# Altium project nixie_clock.PrjPcb
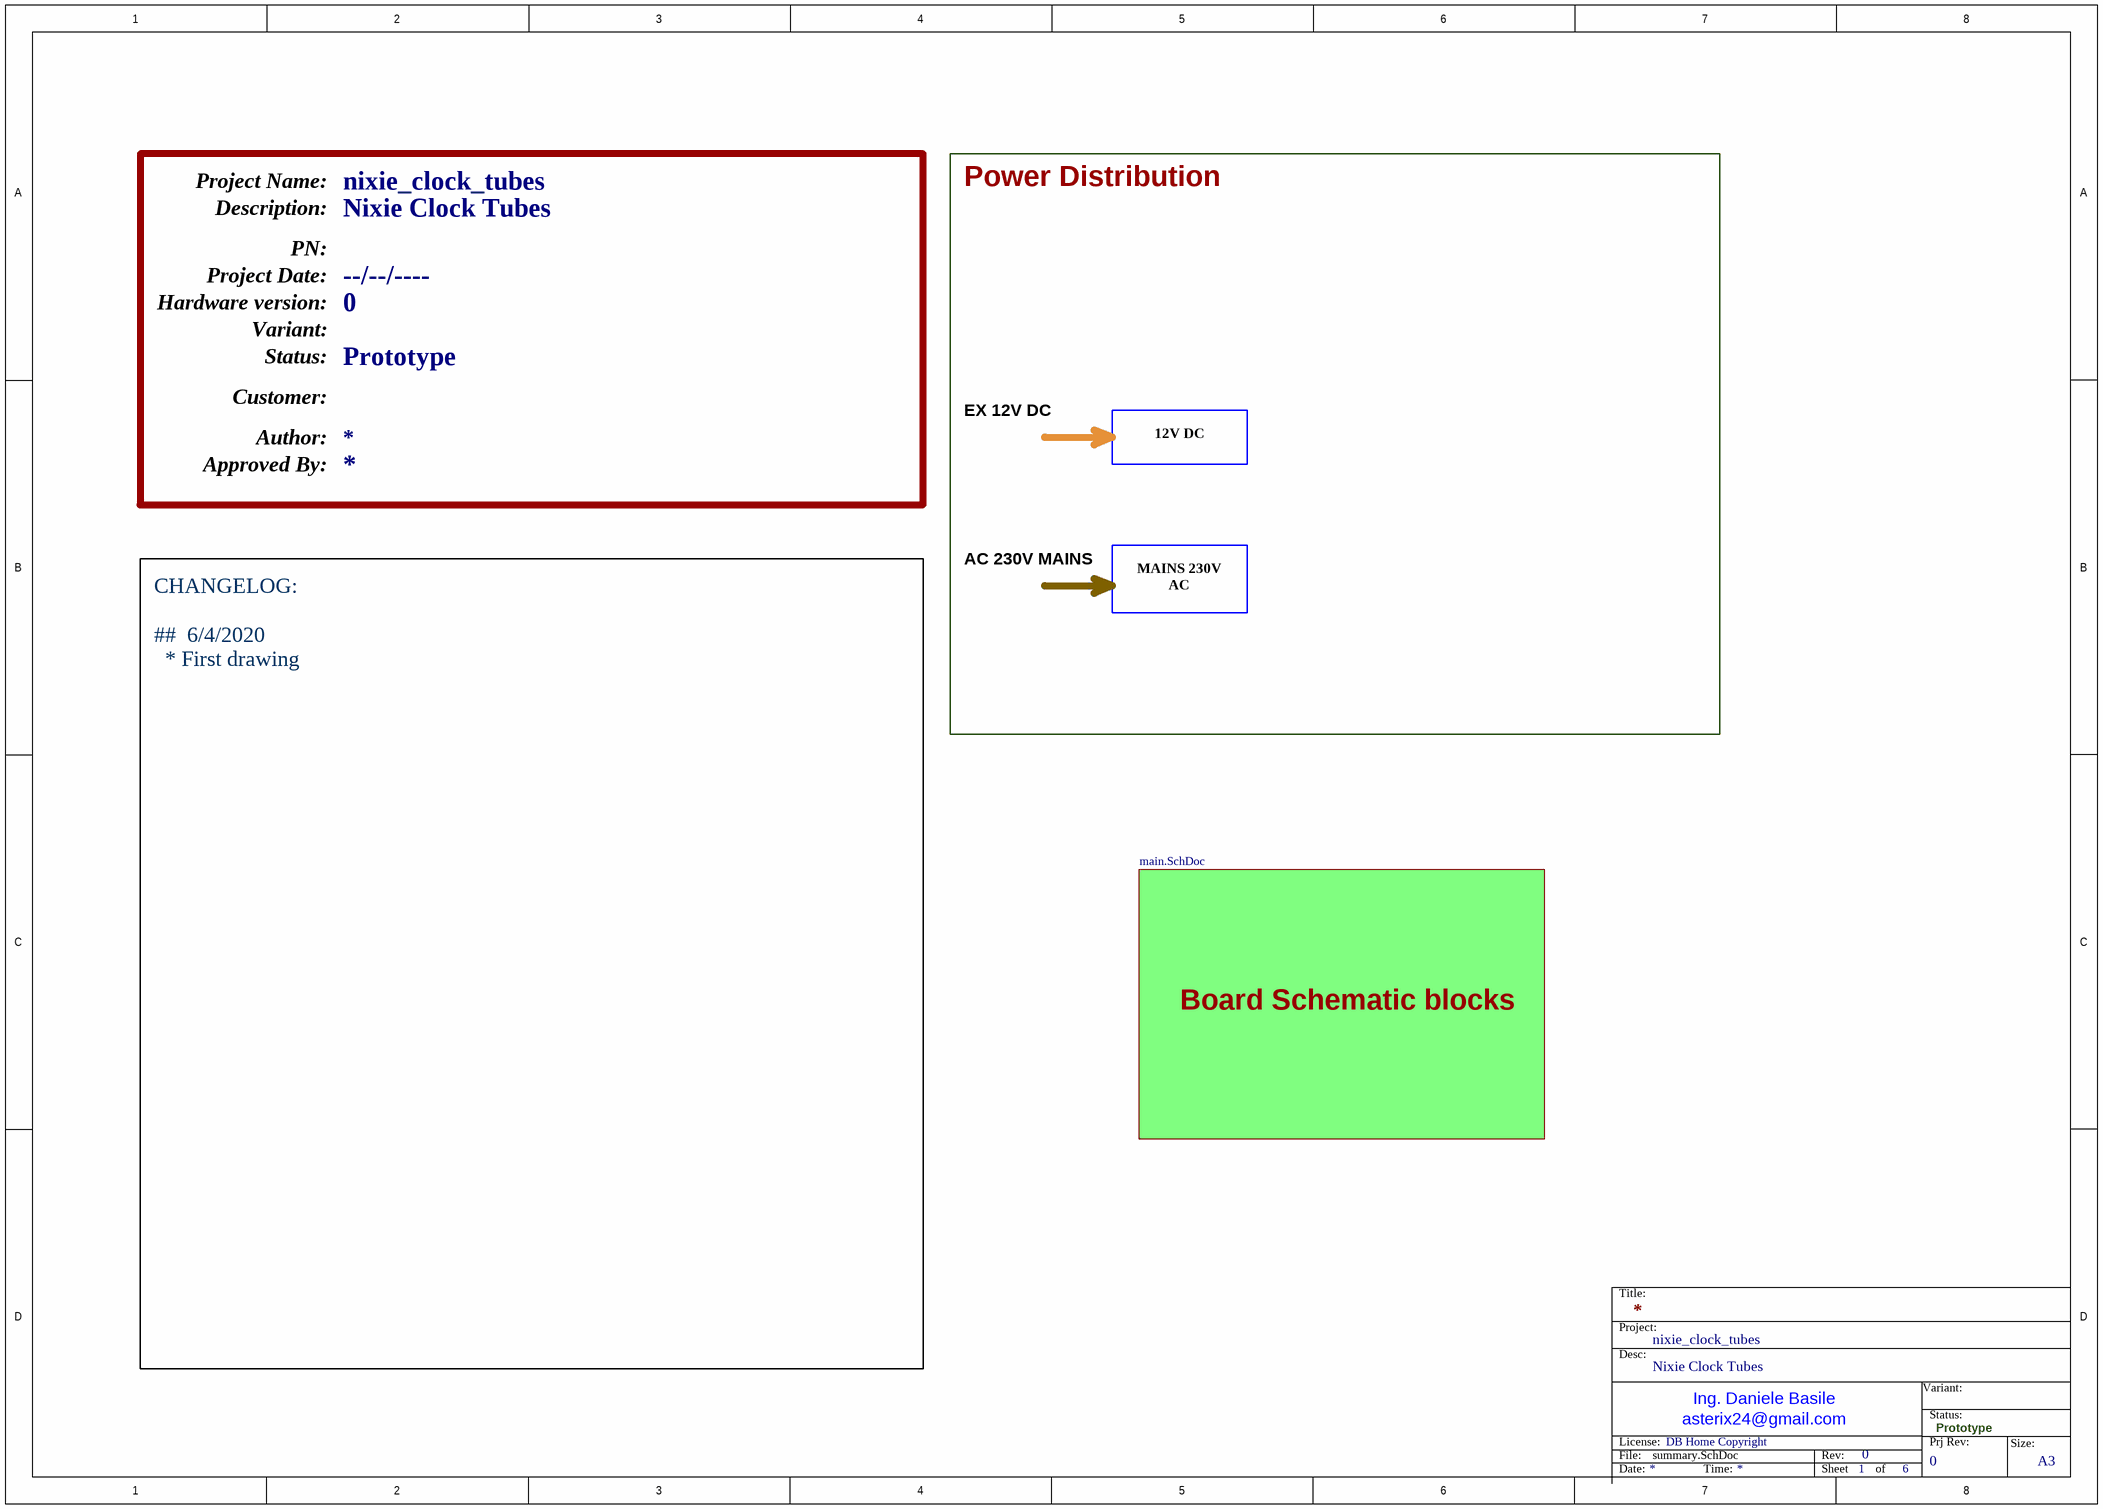
[diagram p0: summary.SchDoc]
prj_status: Prototype; prj_pcb: B; prj_part_number: <PCB PN>; prj_panel_name: nixie_clock_tubes_panel; prj_name_long: Nixie Clock Tubes; prj_name: nixie_clock_tubes; prj_license: DB Home Copyright; prj_hw_ver: 0; prj_date: --/--/----; pcb_title2: <TITLE 2>; pcb_title1: <TITLE 1>; pcb_stackup: Default; pcb_scale: 1:1; pcb_organization: Develer srl; pcb_material: FR4-Standard Tg 130-140C; pcb_layer_count: 2; pcb_finish: HASL; pcb_engineer_app_date: --/--/----; pcb_engineer: - -----; pcb_dwg_no: <PCB DWG NO>; pcb_designer_app_date: --/--/----; pcb_designer: - -----; pcb_checker_app_date: --/--/----; pcb_checker: - -----; pcb_ang_tol: +/-1/2; pcb_address4: ITALIA; pcb_address3: Firenze; pcb_address2: 50013 Campi Bisenzio; pcb_address1: Via San Quirico 233/3; pcb_3_dec_tol: +/-.010; pcb_2_dec_tol: +/-.01
3 sheets, 83 parts. Net scope: hierarchical (ports join the sheet entries above them; power ports are global).
Board file: nixi_tube.PcbDoc
Sheets:
  summary.SchDoc
     = main.SchDoc
      Hx:xx = tube.SchDoc
      xH:xx = tube.SchDoc
      xx:Mx = tube.SchDoc
      xx:xM = tube.SchDoc

## Sheet summary.SchDoc
size A3; Hw_rev: R1; Address3: Firenze; Address4: ITALY; Revision: 0; SheetNumber: 1; SheetTotal: 6

### Sub-sheets
? = main.SchDoc: no entries

### Notes on the sheet
- Project Name:
- Description:
- PN:
- Power Distribution
- Hardware version:
- Project Date:
- Variant:
- Status:
- Author:
- Customer:
- EX 12V DC
- Approved By:
- 12V DC
- AC 230V MAINS
- MAINS 230V AC
- Board Schematic blocks
- CHANGELOG:
  ##  6/4/2020
  * First drawing
- Title:
- Project:
- Desc:
- File:
- License:
- asterix24@gmail.com
- Ing. Daniele Basile
- Rev:
- Prj Rev:
- Size:
- Date:
- Time:
- Sheet
- of
- A3

## Sheet main.SchDoc
size A3; Hw_rev: R1; Address3: Firenze; Address4: ITALY; Revision: 0; SheetNumber: 2; SheetTotal: 4
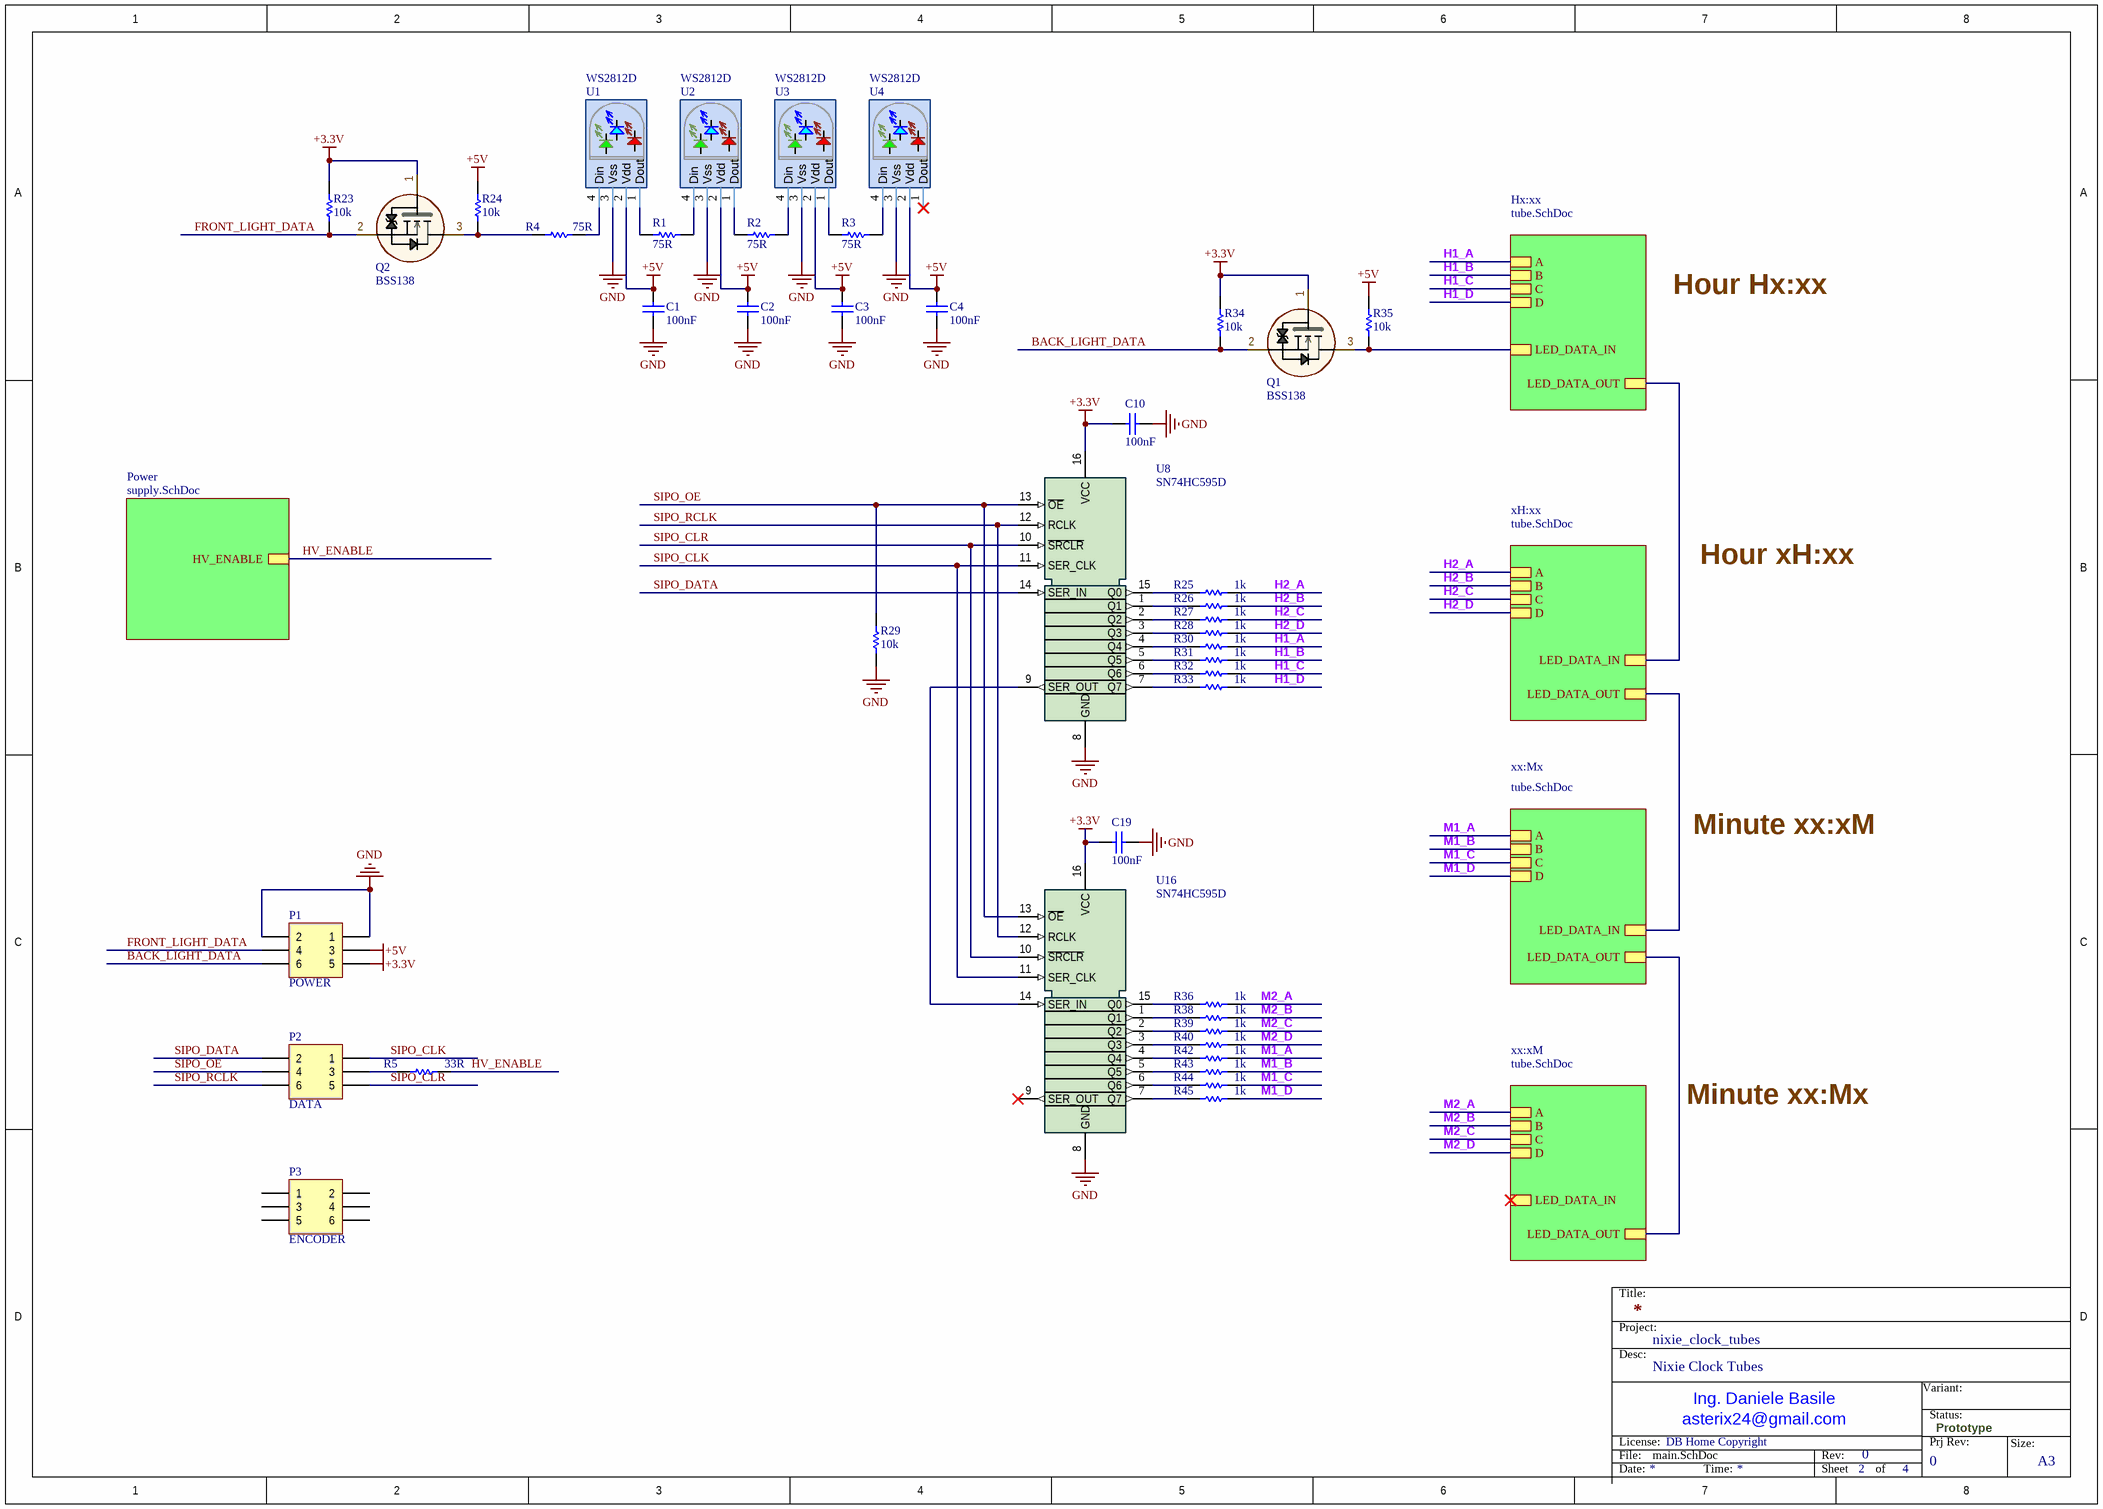
[diagram p1: main.SchDoc]

### Parts
C1  100nF  [0603_[1608]]
C2  100nF  [0603_[1608]]
C3  100nF  [0603_[1608]]
C4  100nF  [0603_[1608]]
C10  100nF  [0603_[1608]]
C19  100nF  [0603_[1608]]
P1  POWER  [HEADER_2X3_2.54MM_THD]
P2  DATA  [HEADER_2X3_2.54MM_THD]
P3  ENCODER  [HEADER_2X3_2.54MM_THD]
Q1  BSS138  [SOT-23]
Q2  BSS138  [SOT-23]
R1  75R  [0603_[1608]]
R2  75R  [0603_[1608]]
R3  75R  [0603_[1608]]
R4  75R  [0603_[1608]]
R5  33R  [0603_[1608]]
R23  10k  [0603_[1608]]
R24  10k  [0603_[1608]]
R25  1k  [0603_[1608]]
R26  1k  [0603_[1608]]
R27  1k  [0603_[1608]]
R28  1k  [0603_[1608]]
R29  10k  [0603_[1608]]
R30  1k  [0603_[1608]]
R31  1k  [0603_[1608]]
R32  1k  [0603_[1608]]
R33  1k  [0603_[1608]]
R34  10k  [0603_[1608]]
R35  10k  [0603_[1608]]
R36  1k  [0603_[1608]]
R38  1k  [0603_[1608]]
R39  1k  [0603_[1608]]
R40  1k  [0603_[1608]]
R42  1k  [0603_[1608]]
R43  1k  [0603_[1608]]
R44  1k  [0603_[1608]]
R45  1k  [0603_[1608]]
U1  WS2812D  [R5_RGB_LED_THD]
U2  WS2812D  [R5_RGB_LED_THD]
U3  WS2812D  [R5_RGB_LED_THD]
U4  WS2812D  [R5_RGB_LED_THD]
U8  SN74HC595D  [soic16]
U16  SN74HC595D  [soic16]

### Sub-sheets
Hx:xx = tube.SchDoc: LED_DATA_IN, LED_DATA_OUT, A, B, C, D
Power = supply.SchDoc (file not in this document): HV_ENABLE
xH:xx = tube.SchDoc: LED_DATA_IN, LED_DATA_OUT, A, B, C, D
xx:Mx = tube.SchDoc: LED_DATA_IN, LED_DATA_OUT, A, B, C, D
xx:xM = tube.SchDoc: LED_DATA_IN, LED_DATA_OUT, A, B, C, D

### Nets
+3.3V: C10.2 C19.2 P1.5 Q1.1(G) Q2.1(G) R23.1 R34.1 U8.16(VCC) U16.16(VCC)
+5V: C1.1 C2.1 C3.1 C4.1 P1.3 R24.1 R35.1 U1.2(Vdd) U2.2(Vdd) U3.2(Vdd) U4.2(Vdd)
GND: C1.2 C2.2 C3.2 C4.2 C10.1 C19.1 P1.1 P1.2 R29.2 U1.3(Vss) U2.3(Vss) U3.3(Vss) U4.3(Vss) U8.8(GND) U16.8(GND)
BACK_LIGHT_DATA: P1.6 Q1.2(S) R34.2
FRONT_LIGHT_DATA: P1.4 Q2.2(S) R23.2
H1_A: R30.1 ; sheet Hx:xx/A  [project net A]
H1_B: R31.1 ; sheet Hx:xx/B  [project net B]
H1_C: R32.1 ; sheet Hx:xx/C  [project net C]
H1_D: R33.1 ; sheet Hx:xx/D  [project net D]
H2_A: R25.1 ; sheet xH:xx/A  [project net A]
H2_B: R26.1 ; sheet xH:xx/B  [project net B]
H2_C: R27.1 ; sheet xH:xx/C  [project net C]
H2_D: R28.1 ; sheet xH:xx/D  [project net D]
HV_ENABLE: R5.1 ; sheet Power/HV_ENABLE
LED_DATA_OUT: sheet Hx:xx/LED_DATA_OUT, sheet xH:xx/LED_DATA_IN
LED_DATA_OUT: sheet xH:xx/LED_DATA_OUT, sheet xx:Mx/LED_DATA_IN  [a separate net that carries the same name]
LED_DATA_OUT: sheet xx:Mx/LED_DATA_OUT, sheet xx:xM/LED_DATA_OUT  [a separate net that carries the same name]
M1_A: R42.1 ; sheet xx:Mx/A  [project net A]
M1_B: R43.1 ; sheet xx:Mx/B  [project net B]
M1_C: R44.1 ; sheet xx:Mx/C  [project net C]
M1_D: R45.1 ; sheet xx:Mx/D  [project net D]
M2_A: R36.1 ; sheet xx:xM/A  [project net A]
M2_B: R38.1 ; sheet xx:xM/B  [project net B]
M2_C: R39.1 ; sheet xx:xM/C  [project net C]
M2_D: R40.1 ; sheet xx:xM/D  [project net D]
SIPO_CLK: P2.1 U8.11(SER_CLK) U16.11(SER_CLK)
SIPO_CLR: P2.5 U8.10(~{SRCLR}) U16.10(~{SRCLR})
SIPO_DATA: P2.2 U8.14(SER_IN)
SIPO_OE: P2.4 R29.1 U8.13(~{OE}) U16.13(~{OE})
SIPO_RCLK: P2.6 U8.12(RCLK) U16.12(RCLK)
NetP2_3: P2.3 R5.2
NetQ1_3: Q1.3(D) R35.2 ; sheet Hx:xx/LED_DATA_IN
NetQ2_3: Q2.3(D) R4.2 R24.2
NetR1_1: R1.1 U1.1(Dout)
NetR1_2: R1.2 U2.4(Din)
NetR2_1: R2.1 U2.1(Dout)
NetR2_2: R2.2 U3.4(Din)
NetR3_1: R3.1 U3.1(Dout)
NetR3_2: R3.2 U4.4(Din)
NetR4_1: R4.1 U1.4(Din)
NetR25_2: R25.2 U8.15(Q0)
NetR26_2: R26.2 U8.1(Q1)
NetR27_2: R27.2 U8.2(Q2)
NetR28_2: R28.2 U8.3(Q3)
NetR30_2: R30.2 U8.4(Q4)
NetR31_2: R31.2 U8.5(Q5)
NetR32_2: R32.2 U8.6(Q6)
NetR33_2: R33.2 U8.7(Q7)
NetR36_2: R36.2 U16.15(Q0)
NetR38_2: R38.2 U16.1(Q1)
NetR39_2: R39.2 U16.2(Q2)
NetR40_2: R40.2 U16.3(Q3)
NetR42_2: R42.2 U16.4(Q4)
NetR43_2: R43.2 U16.5(Q5)
NetR44_2: R44.2 U16.6(Q6)
NetR45_2: R45.2 U16.7(Q7)
NetU8_9: U8.9(SER_OUT) U16.14(SER_IN)

Not connected (* = marked no-connect by the designer): P3 1 2 3 4 5 6; U4 1(Dout)*; U16 9(SER_OUT)*

### Notes on the sheet
- Hour Hx:xx
- Hour xH:xx
- Minute xx:xM
- Minute xx:Mx
- Title:
- Project:
- Desc:
- Variant:
- File:
- License:
- asterix24@gmail.com
- Ing. Daniele Basile
- Rev:
- Prj Rev:
- Status:
- Size:
- Date:
- Time:
- Sheet
- of
- A3

### Library data of the parts
C1-C4 C10 C19 = Cap: Capacitor; Value: 100nF; NOTE Manufacturer PN: *; NOTE Manufacturer: *; MountTechnology: *; CODE Develer: *; ComponentLink1Description: New link; ComponentLink1URL: *; NOTE Description: *; NOTE Description 2: *
P1-P3 = Header 3X2: Header, 3-Pin, Dual row; LatestRevisionDate: 17-Jul-2002; LatestRevisionNote: Re-released for DXP Platform.; Publisher: Altium Limited
Q1 Q2 = BSS138: N-MOSFET 50V 0,22A; Publisher: Develer srl; Revision: 0.1; NOTE Manufacturer PN: *; NOTE Manufacturer: *; MountTechnology: SMT; CODE Develer: *; NOTE Description: *; NOTE Description 2: *
R1-R5 R23-R36 R38-R40 R42-R45 = Res: Resistor; Publisher: Develer srl; Revision: 0.1; NOTE Manufacturer PN: *; NOTE Manufacturer: *; MountTechnology: SMT; CODE Develer: *; NOTE Description: *; NOTE Description 2: *
U1-U4 = WS2812D: Adressable Led RGB 1wire, THD; Publisher: Develer srl; Revision: 0.1; NOTE Manufacturer PN: *; NOTE Manufacturer: *; MountTechnology: SMT; CODE Develer: *; NOTE Description: *; NOTE Description 2: *; CODE LCSC: C190565
U8 U16 = SN74HC595D: 8-Bit Shift Registers With 3-State Output Registers; Publisher: Develer srl; Revision: 0.1; NOTE Manufacturer PN: *; NOTE Manufacturer: *; MountTechnology: SMT; CODE Develer: *; NOTE Description: *; NOTE Description 2: *; Supplier 1: Digi-Key; Supplier 2: Newark; Supplier 3: Newark; Supplier 4: Avnet; Supplier Part Number 1: 497-2344-5-ND; Supplier Part Number 2: 26AC5117; Supplier Part Number 3: 89K1130; Supplier Part Number 4: ULN2003A

## Sheet tube.SchDoc
size A3; Hw_rev: R1; Address3: Firenze; Address4: ITALY; Revision: 0; SheetNumber: 4; SheetTotal: 4
Used 4 times, as channels /Hx:xx, /xH:xx, /xx:Mx, /xx:xM. Parts and nets are listed once, with the designators drawn on the sheet.
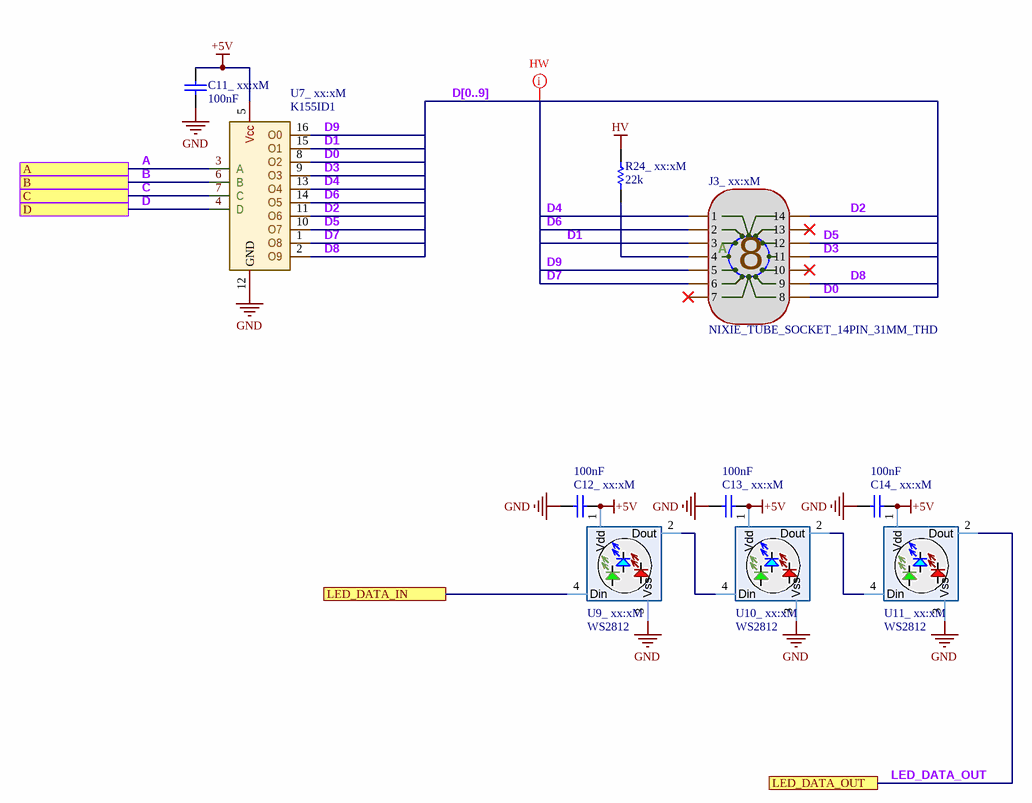
[diagram p2: tube.SchDoc]

### Parts
C11__xx:xM  100nF  [0603_[1608]]
C12__xx:xM  100nF  [0603_[1608]]
C13__xx:xM  100nF  [0603_[1608]]
C14__xx:xM  100nF  [0603_[1608]]
J3__xx:xM  NIXIE_TUBE_SOCKET_14PIN_31MM_THD  [SOCKET_NIXI_TUBE]
R24__xx:xM  22k  [AXIAL 10mm]
U7__xx:xM  K155ID1  [DIP-16_THD]
U9__xx:xM  WS2812  [LED_PLCC_RGB_4P_1010]
U10__xx:xM  WS2812  [LED_PLCC_RGB_4P_1010]
U11__xx:xM  WS2812  [LED_PLCC_RGB_4P_1010]

### Ports
A, B, C, D, LED_DATA_IN, LED_DATA_OUT

### Nets
+5V: C11__xx:xM.2 C12__xx:xM.2 C13__xx:xM.2 C14__xx:xM.2 U7__xx:xM.5(Vcc) U9__xx:xM.1(Vdd) U10__xx:xM.1(Vdd) U11__xx:xM.1(Vdd)
GND: C11__xx:xM.1 C12__xx:xM.1 C13__xx:xM.1 C14__xx:xM.1 U7__xx:xM.12(GND) U9__xx:xM.3(Vss) U10__xx:xM.3(Vss) U11__xx:xM.3(Vss)
HV: R24__xx:xM.2
A: U7__xx:xM.3(A) ; port A
B: U7__xx:xM.6(B) ; port B
C: U7__xx:xM.7(C) ; port C
D: U7__xx:xM.4(D) ; port D
D0: J3__xx:xM.8 U7__xx:xM.8(O2)
D1: J3__xx:xM.3 U7__xx:xM.15(O1)
D2: J3__xx:xM.14 U7__xx:xM.11(O6)
D3: J3__xx:xM.11 U7__xx:xM.9(O3)
D4: J3__xx:xM.1 U7__xx:xM.13(O4)
D5: J3__xx:xM.12 U7__xx:xM.10(O7)
D6: J3__xx:xM.2 U7__xx:xM.14(O5)
D7: J3__xx:xM.6 U7__xx:xM.1(O8)
D8: J3__xx:xM.9 U7__xx:xM.2(O9)
D9: J3__xx:xM.5 U7__xx:xM.16(O0)
LED_DATA_IN: U9__xx:xM.4(Din) ; port LED_DATA_IN
LED_DATA_OUT: U11__xx:xM.2(Dout) ; port LED_DATA_OUT
NetJ3__xx:xM_4: J3__xx:xM.4 R24__xx:xM.1
NetU9__xx:xM_2: U9__xx:xM.2(Dout) U10__xx:xM.4(Din)
NetU10__xx:xM_2: U10__xx:xM.2(Dout) U11__xx:xM.4(Din)

Not connected (* = marked no-connect by the designer): J3__xx:xM 7* 10* 13*

### Channels
/Hx:xx: designators C11_ xx:xM=C11__xx:xM_Hx:xx C12_ xx:xM=C12__xx:xM_Hx:xx C13_ xx:xM=C13__xx:xM_Hx:xx C14_ xx:xM=C14__xx:xM_Hx:xx J3_ xx:xM=J3__xx:xM_Hx:xx R24_ xx:xM=R24__xx:xM_Hx:xx U7_ xx:xM=U7__xx:xM_Hx:xx U9_ xx:xM=U9__xx:xM_Hx:xx U10_ xx:xM=U10__xx:xM_Hx:xx U11_ xx:xM=U11__xx:xM_Hx:xx; ports A=A B=B C=C D=D LED_DATA_IN=NetQ1_3 LED_DATA_OUT=LED_DATA_OUT
/xH:xx: designators C11_ xx:xM=C11__xx:xM_xH:xx C12_ xx:xM=C12__xx:xM_xH:xx C13_ xx:xM=C13__xx:xM_xH:xx C14_ xx:xM=C14__xx:xM_xH:xx J3_ xx:xM=J3__xx:xM_xH:xx R24_ xx:xM=R24__xx:xM_xH:xx U7_ xx:xM=U7__xx:xM_xH:xx U9_ xx:xM=U9__xx:xM_xH:xx U10_ xx:xM=U10__xx:xM_xH:xx U11_ xx:xM=U11__xx:xM_xH:xx; ports A=A B=B C=C D=D LED_DATA_IN=LED_DATA_OUT LED_DATA_OUT=LED_DATA_OUT
/xx:Mx: designators C11_ xx:xM=C11__xx:xM_xx:Mx C12_ xx:xM=C12__xx:xM_xx:Mx C13_ xx:xM=C13__xx:xM_xx:Mx C14_ xx:xM=C14__xx:xM_xx:Mx J3_ xx:xM=J3__xx:xM_xx:Mx R24_ xx:xM=R24__xx:xM_xx:Mx U7_ xx:xM=U7__xx:xM_xx:Mx U9_ xx:xM=U9__xx:xM_xx:Mx U10_ xx:xM=U10__xx:xM_xx:Mx U11_ xx:xM=U11__xx:xM_xx:Mx; ports A=A B=B C=C D=D LED_DATA_IN=LED_DATA_OUT LED_DATA_OUT=LED_DATA_OUT
/xx:xM: designators C11_ xx:xM=C11__xx:xM_xx:xM C12_ xx:xM=C12__xx:xM_xx:xM C13_ xx:xM=C13__xx:xM_xx:xM C14_ xx:xM=C14__xx:xM_xx:xM J3_ xx:xM=J3__xx:xM_xx:xM R24_ xx:xM=R24__xx:xM_xx:xM U7_ xx:xM=U7__xx:xM_xx:xM U9_ xx:xM=U9__xx:xM_xx:xM U10_ xx:xM=U10__xx:xM_xx:xM U11_ xx:xM=U11__xx:xM_xx:xM; ports A=A B=B C=C D=D LED_DATA_IN=NetU9__xx:xM_xx:xM_4 LED_DATA_OUT=LED_DATA_OUT

### Buses and harness runs
bus D[0..9]

### Layout directives
net class HV: (no net found under the mark)

### Notes on the sheet
- Title:
- Project:
- Desc:
- Variant:
- File:
- License:
- asterix24@gmail.com
- Ing. Daniele Basile
- Rev:
- Prj Rev:
- Status:
- Size:
- Date:
- Time:
- Sheet
- of
- A3
- (in symbol CMP-057-000033-2) A

### Library data of the parts
C11__xx:xM C12__xx:xM C13__xx:xM C14__xx:xM = Cap: Capacitor; Value: 100nF; NOTE Manufacturer PN: *; NOTE Manufacturer: *; MountTechnology: *; CODE Develer: *; ComponentLink1Description: New link; ComponentLink1URL: *; NOTE Description: *; NOTE Description 2: *
J3__xx:xM = CMP-057-000033-2: Design Item ID: NIXIE_TUBE_SOCKET_14PIN_31MM_THD; NOTE Manufacturer: *; CODE Develer: *; NOTE Manufacturer PN: *; NOTE Description: *; NOTE Description 2: *; Publisher: Develer srl; Revision: 0.1; MountTechnology: SMT
R24__xx:xM = Res: Resistor; Publisher: Develer srl; Revision: 0.1; NOTE Manufacturer PN: *; NOTE Manufacturer: *; MountTechnology: SMT; CODE Develer: *; NOTE Description: *; NOTE Description 2: *
U7__xx:xM = K155ID1: Nixie Tube HV Driver; Publisher: Develer srl; Revision: 0.1; NOTE Manufacturer PN: *; NOTE Manufacturer: *; MountTechnology: SMT; CODE Develer: *; NOTE Description: *; NOTE Description 2: *
U9__xx:xM U10__xx:xM U11__xx:xM = WS2812: Adressable Led RGB 1wire; Publisher: Develer srl; Revision: 0.1; NOTE Manufacturer PN: *; NOTE Manufacturer: *; MountTechnology: SMT; CODE Develer: *; NOTE Description: *; NOTE Description 2: *; CODE LCSC: C5349953
  U9__xx:xM: Parameter 1: *

## Nets that join several sheets
+5V: main (11 pins), /Hx:xx (8 pins), /xH:xx (8 pins), /xx:Mx (8 pins), /xx:xM (8 pins)
GND: main (15 pins), /Hx:xx (8 pins), /xH:xx (8 pins), /xx:Mx (8 pins), /xx:xM (8 pins)
HV: /Hx:xx (R24__xx:xM_Hx:xx.2), /xH:xx (R24__xx:xM_xH:xx.2), /xx:Mx (R24__xx:xM_xx:Mx.2), /xx:xM (R24__xx:xM_xx:xM.2)
A: main (R25.1), /xH:xx (U7__xx:xM_xH:xx.3)
A: main (R30.1), /Hx:xx (U7__xx:xM_Hx:xx.3)
A: main (R36.1), /xx:xM (U7__xx:xM_xx:xM.3)
A: main (R42.1), /xx:Mx (U7__xx:xM_xx:Mx.3)
B: main (R26.1), /xH:xx (U7__xx:xM_xH:xx.6)
B: main (R31.1), /Hx:xx (U7__xx:xM_Hx:xx.6)
B: main (R38.1), /xx:xM (U7__xx:xM_xx:xM.6)
B: main (R43.1), /xx:Mx (U7__xx:xM_xx:Mx.6)
C: main (R27.1), /xH:xx (U7__xx:xM_xH:xx.7)
C: main (R32.1), /Hx:xx (U7__xx:xM_Hx:xx.7)
C: main (R39.1), /xx:xM (U7__xx:xM_xx:xM.7)
C: main (R44.1), /xx:Mx (U7__xx:xM_xx:Mx.7)
D: main (R28.1), /xH:xx (U7__xx:xM_xH:xx.4)
D: main (R33.1), /Hx:xx (U7__xx:xM_Hx:xx.4)
D: main (R40.1), /xx:xM (U7__xx:xM_xx:xM.4)
D: main (R45.1), /xx:Mx (U7__xx:xM_xx:Mx.4)
LED_DATA_OUT: /Hx:xx (U11__xx:xM_Hx:xx.2), /xH:xx (U9__xx:xM_xH:xx.4)
LED_DATA_OUT: /xH:xx (U11__xx:xM_xH:xx.2), /xx:Mx (U9__xx:xM_xx:Mx.4)
LED_DATA_OUT: /xx:Mx (U11__xx:xM_xx:Mx.2), /xx:xM (U11__xx:xM_xx:xM.2)
NetQ1_3: main (Q1.3 R35.2), /Hx:xx (U9__xx:xM_Hx:xx.4)